# Altium schematic sheet SHDN-BSPD-S10-V00-ShutdownRelay.SchDoc
size A3
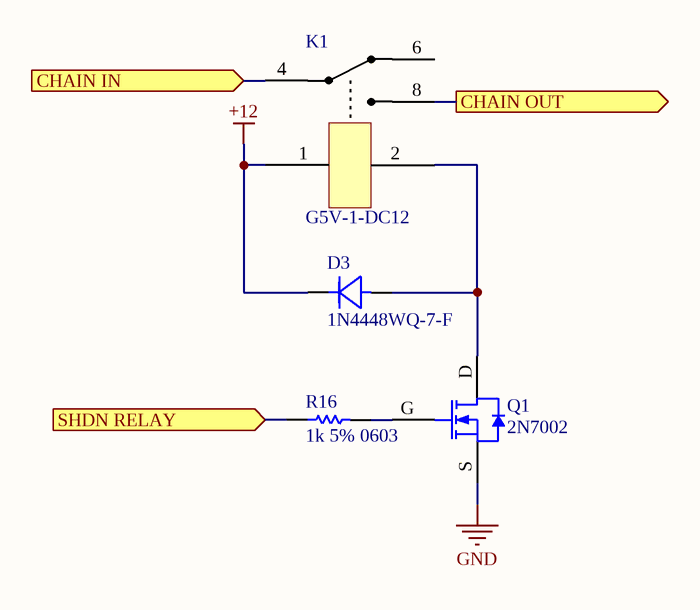
[diagram p0: SHDN-BSPD-S10-V00-ShutdownRelay.SchDoc]

## Parts
D3  1N4448WQ-7-F  [SMA]
K1  G5V-1-DC12  [G5V-1]
Q1  2N7002  [SOT23-3]
R16  1k 5% 0603  [Res_ThinFilm_0603]

## Ports
CHAIN IN (in), CHAIN OUT (out), SHDN RELAY (in)

## Nets
+12: D3.K(Cathode) K1.1
GND: Q1.S
CHAIN IN: K1.4 ; port CHAIN IN
CHAIN OUT: K1.8 ; port CHAIN OUT
SHDN RELAY: R16.1 ; port SHDN RELAY
NetD3_A: D3.A(Anode) K1.2 Q1.D
NetQ1_G: Q1.G R16.2

Not connected (* = marked no-connect by the designer): K1 6

## Notes on the sheet
- Title
- Size:
- Date:
- A3
- Number:
- Time:
- Revision:
- Sheet
- of
- File:

## Library data of the parts
D3 = 1N4448WQ-7-F: Diode, SMD, 75V, 5%, 250mA, SOD123; Manufacturer: ON Semiconductor / Fairchild; Manufacturer Part Number: 1N914BWS; Average Rectified Current: 150mA; Element Configuration: Single; Forward Voltage: 1V; Max Reverse Leakage Current: 5uA; Power Dissipation: 200mW; Recovery Time: 4ns; Max Forward Surge Current (Ifsm): 4A; Parameter 1: *; Weight: 0.0276g; Category: Rectifier Diodes; Contact Plating: Tin,Matte; Forward Current: 150mA; Lead Free: Lead Free; Max Operating Temperature: 150°C; Max Repetitive Reverse Voltage (Vrrm): 75V; Max Reverse Voltage (DC): 75V; Min Operating Temperature: -55°C; Mount: Surface Mount; Number of Pins: 2; Package Quantity: 1; Packaging: Tape and Reel; Peak Reverse Current: 5uA; Radiation Hardening: No; REACH SVHC: No SVHC; Reverse Recovery Time: 4ns; Height: 1mm; Length: 1.8mm; Reverse Voltage: 75V; Width: 1.35mm
K1 = G5V-1-DC12: General Purpose Relay SPDT (1 Form C) Through Hole, 12V, 2A
R16 = 1k 5% 0603: Resistor, SMD, 1k, 0.1W, 5%, 0603